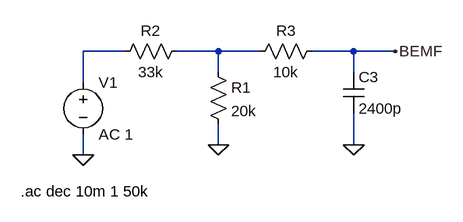
[diagram p0: schematic BEMF_Filter.asc]
BEMF_Filter.asc, the LTspice schematic file:
Version 4
SHEET 1 1400 680
WIRE -96 -848 -160 -848
WIRE 48 -848 -16 -848
WIRE 112 -848 48 -848
WIRE 256 -848 192 -848
WIRE 320 -848 256 -848
WIRE 48 -816 48 -848
WIRE 256 -816 256 -848
WIRE -160 -800 -160 -848
WIRE 48 -704 48 -736
WIRE 256 -704 256 -752
WIRE -160 -688 -160 -720
FLAG -160 -688 0
FLAG 256 -704 0
FLAG 48 -704 0
FLAG 320 -848 BEMF
SYMBOL voltage -160 -816 R0
WINDOW 123 0 0 Left 0
WINDOW 39 0 0 Left 0
SYMATTR InstName V1
SYMATTR Value AC 1
SYMBOL cap 240 -816 R0
SYMATTR InstName C3
SYMATTR Value 2400p
SYMBOL res 32 -832 R0
SYMATTR InstName R1
SYMATTR Value 20k
SYMBOL res 0 -864 R90
WINDOW 0 0 56 VBottom 2
WINDOW 3 32 56 VTop 2
SYMATTR InstName R2
SYMATTR Value 33k
SYMBOL res 208 -864 R90
WINDOW 0 0 56 VBottom 2
WINDOW 3 32 56 VTop 2
SYMATTR InstName R3
SYMATTR Value 10k
TEXT -256 -632 Left 2 !.ac dec 10m 1 50k

The netlist it stands for:
* BEMF_Filter.asc
V1 N001 0 AC 1
C3 BEMF 0 2400p
R1 N002 0 20k
R2 N002 N001 33k
R3 BEMF N002 10k
.ac dec 10m 1 50k
.backanno
.end